# EAGLE schematic adapter (EAGLE 9.5.1)
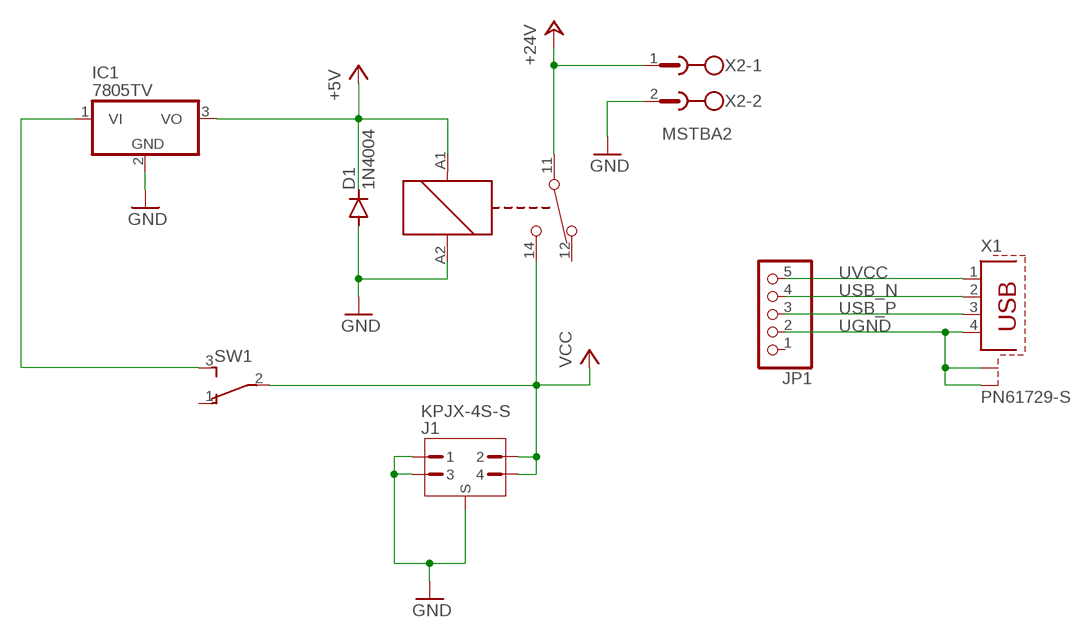
[diagram p0: schematic, sheet 1]

## Parts
D1  1N4004  [DO41-10]
IC1  7805TV  [TO220V]
J1  KPJX-4S-S  [KPJX-4S-S]
JP1  PINHD-1X5/90  [1X05/90]
K1  36.11.9.005.4011  [36.11-4011]
SW1  SPDT-90  [SPDT-90]
X1  PN61729-S  [PN61729-S]
X2  MSTBA2  [MSTBA2]

## Nets
+5V: D1.C IC1.3(VO) K1.A1
+24V: K1.11 X2.1
GND: D1.A IC1.2(GND) J1.1 J1.1A J1.1B J1.1C J1.1D J1.1E J1.1F J1.1G J1.1H J1.3 J1.3A J1.3B J1.3C J1.3D J1.3E J1.3F J1.3G J1.3H J1.S1(S) J1.S1A(S) J1.S1B(S) J1.S1C(S) J1.S1D(S) J1.S1E(S) J1.S1F(S) J1.S1G(S) J1.S1H(S) J1.S2(S) J1.S2A(S) J1.S2B(S) J1.S2C(S) J1.S2D(S) J1.S2E(S) J1.S2F(S) J1.S2G(S) J1.S2H(S) J1.S3(S) J1.S4(S) J1.S5(S) J1.S5A(S) J1.S5B(S) K1.A2 X2.2
UGND: JP1.2 X1.4 X1.S1 X1.S2
USB_N [diff]: JP1.4 X1.2
USB_P [diff]: JP1.3 X1.3
UVCC: JP1.5 X1.1
VCC: J1.2 J1.2A J1.2B J1.2C J1.2D J1.2E J1.2F J1.2G J1.2H J1.4 J1.4A J1.4B J1.4C J1.4D J1.4E J1.4F J1.4G J1.4H K1.14 SW1.2(P)
VCC/2: IC1.1(VI) SW1.3(S)
Unconnected: JP1.1 K1.12 SW1.1(O)

## Library data of the parts
D1 = diode:1N4004: DIODE general purpose rectifier, 1 A
IC1 = linear:78*: Positive VOLTAGE REGULATOR Source: http://cache.national.com/ds/LM/LM78L05.pdf http://www.fairchildsemi.com/ds/LM/LM7805.pdf
J1 = misc:KPJX-4S-S
JP1 = pinhead:PINHD-1X5: PIN HEADER
K1 = misc:36.11.9.005.4011
SW1 = misc:SPDT-90
X1 = con-berg:PN61729-S: BERG USB connector; OC_FARNELL: unknown; OC_NEWARK: unknown
X2 = con-phoenix-508:MSTBA2: PHOENIX; MF: FARNELL; MPN: 1757242; OC_FARNELL: 3705171; OC_NEWARK: 71C4161

## Net classes
1 diff: clearance 0.5 mm